# EasyEDA Pro project ChisFlash-MBC5_GBC烧录卡_shn修改plus图纸nds烧录线路+电池加固通孔.epro, schematic ChisFlash-MBC5-Plus-v1.1
Board Name: ChisFlash-MBC5-Plus-v1.1; Create Date: 2024-11-11; Page Name: 1; Project Name: ChisFlash-MBC5（GBC烧录卡）; Schematic Name: ChisFlash-MBC5-Plus-v1.1; Update Date: 2024-11-11; Company: 嘉立创EDA; Page Size: A4; Version: V1.0
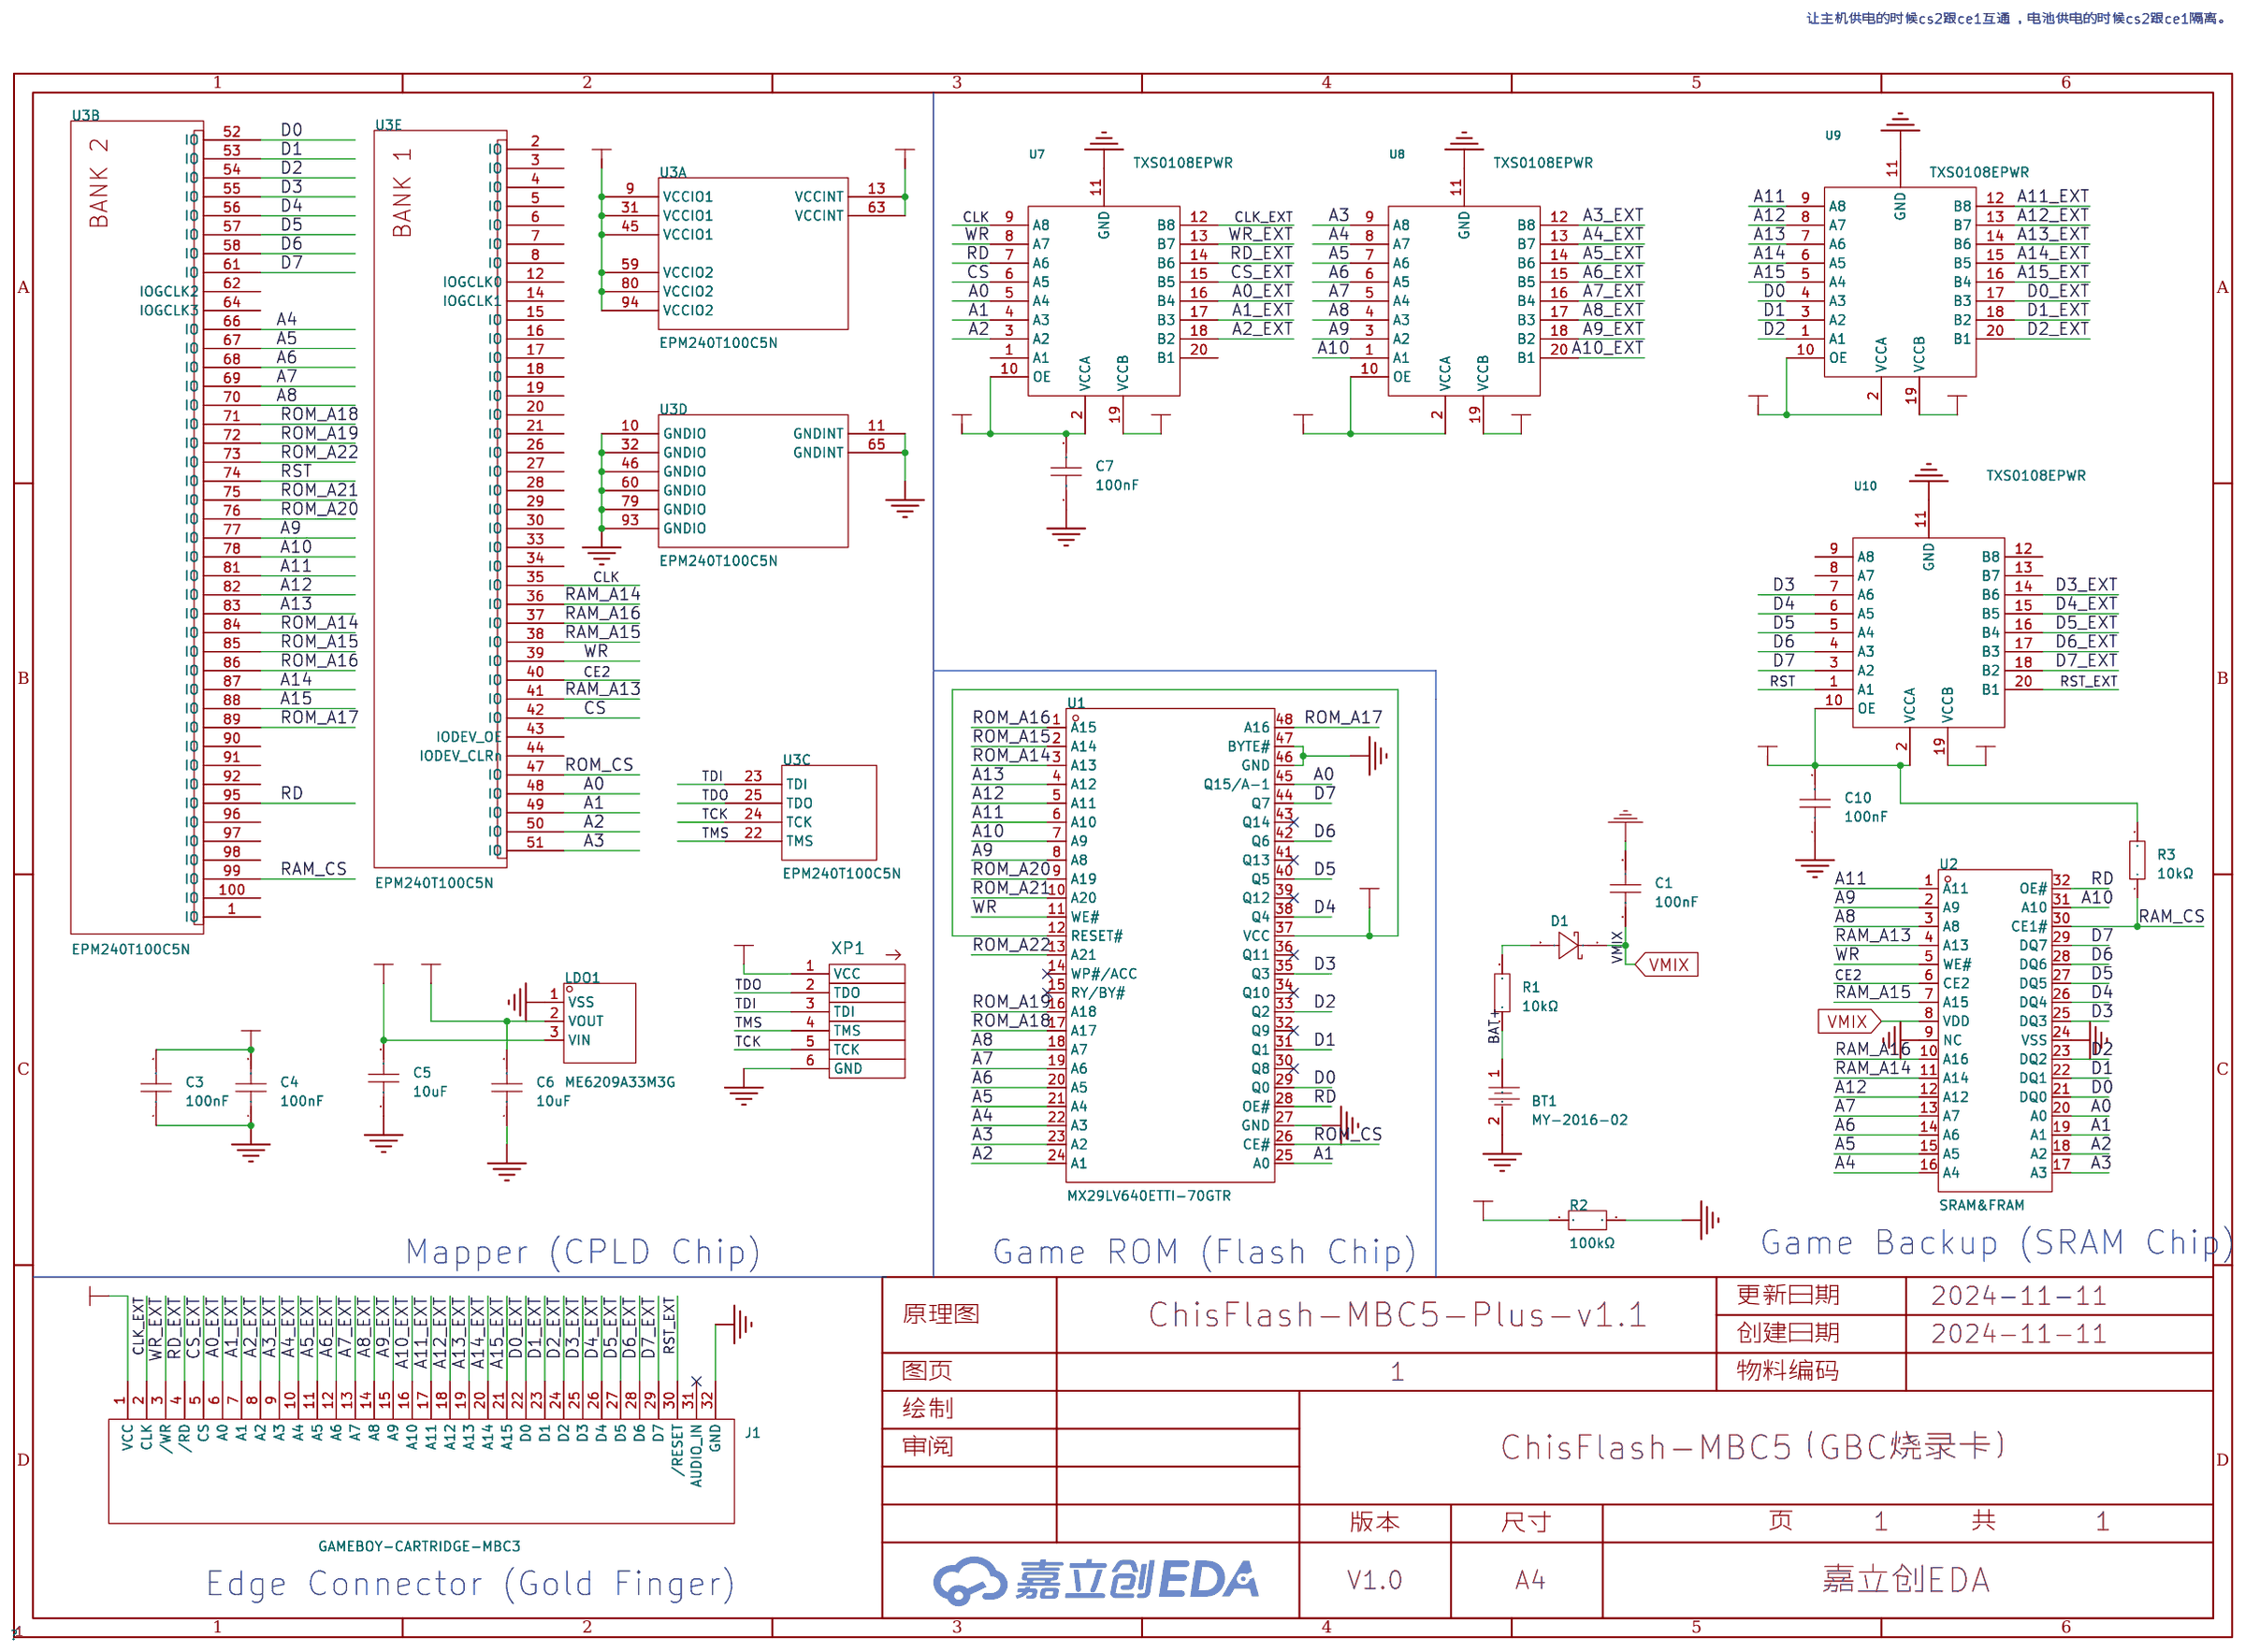
[diagram p0: schematic sheet]

## Parts
BT1  MY-2016-02  [BAT-SMD_MY-2032-08]
C1  100nF  [C0603]
C3  100nF  [C0603]
C4  100nF  [C0603]
C5  10uF  [C0603]
C6  10uF  [C0603]
C7  100nF  [C0603]
C10  100nF  [C0603]
D1  RB751V-40  [SOD-323_L1.7-W1.3-LS2.6-RD-1]
J1  GAMEBOY-CARTRIDGE-MBC3  [GAMEBOY_CARTRIDGE_PIN]
LDO1  ME6209A33M3G  [SOT-23-3_L2.9-W1.6-P1.90-LS2.8-BR]
R1  10kΩ  [R0603]
R2  100kΩ  [R0603]
R3  10kΩ  [R0603]
U1  MX29LV640ETTI-70GTR  [TSOP-48_L12.0-W18.4-P0.50-LS20.0-BL]
U2  SRAM&FRAM  [TSSOP-TSOP二合一]
U3  EPM240T100C5N  [TQFP-100_L14.0-W14.0-P0.50-LS16.0-BL]  (sections 1,2,3,4,5)
U7  TXS0108EPWR  [TSSOP-20_L6.5-W4.4-P0.65-LS6.4-BL]
U8  TXS0108EPWR  [TSSOP-20_L6.5-W4.4-P0.65-LS6.4-BL]
U9  TXS0108EPWR  [TSSOP-20_L6.5-W4.4-P0.65-LS6.4-BL]
U10  TXS0108EPWR  [TSSOP-20_L6.5-W4.4-P0.65-LS6.4-BL]
XP1  JTAG  [HDR-TH_6P-P1.27-V-M-1]  (no BOM)

## Library data of the parts
BT1 = MY-2016-02: 连接器类型:电池扣;适用电池规格:CR2016;触头材质:磷青铜;触点电镀:镍;工作温度范围:-25℃~+85℃;; LCSC Part Name: 电池扣 适用电池:CR2016; Supplier Part: C2979176; Manufacturer: MYOUNG(美阳); Supplier Footprint: SMD; JLCPCB Part Class: Extended Part; Datasheet: https://atta.szlcsc.com/upload/public/pdf/source/20220302/E5D3505CBEA02A6D68587A503653AA7C.pdf; Supplier: LCSC; Connector Type: 电池扣; Battery Type: CR2016; Contact Material: 磷青铜; Contact Plating: 镍; Operating Temperature Range: -25℃~+85℃
C1 C3 C4 C7 C10 = CGA0603X7R104K500JT: 容值:100nF;精度:±10%;额定电压:50V;材质(温度系数):X7R;; LCSC Part Name: 100nF ±10% 50V; Supplier Part: C6119867; Manufacturer: HRE(芯声); Supplier Footprint: 0603; JLCPCB Part Class: Extended Part; Supplier: LCSC; Tolerance: ±10%; Voltage Rated: 50V; Temperature Coefficient: X7R
C5 C6 = CL10A106MA8NRNC: 容值:10uF;精度:±20%;额定电压:25V;材质(温度系数):X5R;; LCSC Part Name: 10uF ±20% 25V; Supplier Part: C96446; Manufacturer: SAMSUNG(三星); Supplier Footprint: 0603; JLCPCB Part Class: 基础库; Datasheet: https://atta.szlcsc.com/upload/public/pdf/source/20160218/1457707763339.pdf; Supplier: LCSC; Tolerance: ±20%; Voltage Rated: 25V; Temperature Coefficient: X5R
D1 = RB751V-40_C7502691: 二极管配置:独立式;正向压降(Vf):370mV@1mA;直流反向耐压(Vr):40V;平均整流电流(Io):30mA;; LCSC Part Name: 电压:40V 电流:30mA; Supplier Part: C7502691; Manufacturer: 宏迦橙; Supplier Footprint: SOD-323; JLCPCB Part Class: Extended Part; Datasheet: https://atta.szlcsc.com/upload/public/pdf/source/20230828/92E6C0C5321000DDFDA2BB61EC3C00B5.pdf; Supplier: LCSC; Diode Configuration: 独立式; Forward Voltage (Vf@If): 370mV@1mA; Reverse Voltage (Vr): 40V; Average Rectified Current (Io): 30mA; Reverse Leakage Current (Ir): 500nA; Peak forward surge current: 200mA
J1 = GAMEBOY-CARTRIDGE-MBC3
LDO1 = ME6209A33M3G: 输出类型:固定;最大输入电压:18V;输出电压:3.3V;最大输出电流:250mA;电源纹波抑制比(PSRR):-;输出极性:正极;; LCSC Part Name: 输入18V 输出3.3V 250mA; Supplier Part: C83508; Manufacturer: MICRONE(南京微盟); Supplier Footprint: SOT-23-3L; JLCPCB Part Class: 扩展库; Datasheet: https://atta.szlcsc.com/upload/public/pdf/source/20161212/1481539101152.pdf; Supplier: LCSC; Output Type: 固定; Maximum Input Voltage: 18V; Output Voltage: 3.3V; MAX Output Current: 250mA; Dropout Voltage: 80mV@(40mA); Output Polarity: 正极; Number of Outputs: 1
R1 R3 = 0603WAF1002T5E: 电阻类型:厚膜电阻;阻值:10kΩ;精度:±1%;功率:100mW;温度系数:±100ppm/℃;最大工作电压:75V;工作温度范围:-55℃~+155℃;; LCSC Part Name: 10kΩ ±1% 100mW; Supplier Part: C25804; Manufacturer: UNI-ROYAL(厚声); Supplier Footprint: 0603; JLCPCB Part Class: Basic Part; Datasheet: https://atta.szlcsc.com/upload/public/pdf/source/20200306/C422600_1E6D84923E4A46A82E41ADD87F860B5C.pdf; Supplier: LCSC; Type: 厚膜电阻; Tolerance: ±1%; Power(Watts): 100mW; Temperature Coefficient: ±100ppm/℃; Overload Voltage (Max): 75V; Operating Temperature Range: -55℃~+155℃; Resistance: 47K
R2 = RT0603BRD1010KL: 电阻类型:薄膜电阻;阻值:10kΩ;精度:±0.1%;功率:100mW;最大工作电压:75V;温度系数:±25ppm/℃;; LCSC Part Name: 薄膜电阻 10kΩ ±0.1% 100mW; Supplier Part: C2087321; Manufacturer: YAGEO(国巨); Supplier Footprint: 0603; JLCPCB Part Class: 扩展库; Datasheet: https://atta.szlcsc.com/upload/public/pdf/source/20200610/C326738_5639A9F1B6EB6E4AE2197577D3456E7F.pdf; Supplier: LCSC; Type: 薄膜电阻; Tolerance: ±0.1%; Power(Watts): 100mW; Overload Voltage (Max): 75V; Temperature Coefficient: ±25ppm/℃; Operating Temperature Range: -55℃~+155℃
U1 = MX29LV640ETTI-70GTR: Supplier Part: C2802730; Manufacturer: MXIC(旺宏电子); JLCPCB Part Class: 扩展库; Supplier: LCSC
U2 = SRAM&FRAM
U3 = EPM240T100C5N: 类型:其它PLD;逻辑门数量:-;逻辑单元数:-;逻辑阵列块数:240;; Supplier Part: C10041; Manufacturer: Intel/Altera; Supplier Footprint: TQFP-100(14x14); JLCPCB Part Class: 扩展库; Datasheet: https://atta.szlcsc.com/upload/public/pdf/source/20121123/1457706563537.pdf; Supplier: LCSC; Type: 其它PLD; Supply Voltage Range - VCCIO: 3.3V；2.5V; Logic Array Blocks: 240; Maximum Delay Time Tpd: 4.7ns; Operating Temperature Range: 0℃~+85℃
U7-U10 = TXS0108EPWR: 数据速率:60Mbps;电压(VCCA):1.4V~3.6V;电压(VCCB):1.65V~5.5V;电路数:1;每个电路通道数:8;; LCSC Part Name: 60Mbps 8位双向电平转换器; Supplier Part: C17206; Manufacturer: TI(德州仪器); Supplier Footprint: TSSOP-20; JLCPCB Part Class: 扩展库; Datasheet: http://www.ti.com/cn/lit/gpn/txs0108e; Supplier: LCSC; Channel Type: 双向; Data Rate: 60Mbps; Supply Voltage (VCCA): 1.4V~3.6V; Supply Voltage (VCCB): 1.65V~5.5V; Number of Circuits: 1; Channels per Circuit: 8; Output Type: 开路漏极；推挽式; Operating Temperature: -40℃~+85℃; Features: 自动方向检测
XP1 = jtag

## Nets
+3V3: C3.2 C4.2 C6.2 C7.2 C10.2 LDO1.2(VOUT) R2.1 R3.2 U1.12(RESET#) U1.37(VCC) U3.9(VCCIO1) U3.13(VCCINT) U3.31(VCCIO1) U3.45(VCCIO1) U3.59(VCCIO2) U3.63(VCCINT) U3.80(VCCIO2) U3.94(VCCIO2) U7.2(VCCA) U7.10(OE) U8.2(VCCA) U8.10(OE) U9.2(VCCA) U9.10(OE) U10.2(VCCA) U10.10(OE) XP1.1(VCC)
+5V: C5.2 J1.1(VCC) LDO1.3(VIN) U7.19(VCCB) U8.19(VCCB) U9.19(VCCB) U10.19(VCCB)
GND: BT1.2 C1.1 C3.1 C4.1 C5.1 C6.1 C7.1 C10.1 J1.32(GND) LDO1.1(VSS) R2.2 U1.27(GND) U1.46(GND) U1.47(BYTE#) U2.9(NC) U2.24(VSS) U3.10(GNDIO) U3.11(GNDINT) U3.32(GNDIO) U3.46(GNDIO) U3.60(GNDIO) U3.65(GNDINT) U3.79(GNDIO) U3.93(GNDIO) U7.11(GND) U8.11(GND) U9.11(GND) U10.11(GND) XP1.6(GND)
A0: U1.45(Q15/A-1) U2.20(A0) U3.48(IO) U7.5(A4)
A0_EXT: J1.6(A0) U7.16(B4)
A1: U1.25(A0) U2.19(A1) U3.49(IO) U7.4(A3)
A1_EXT: J1.7(A1) U7.17(B3)
A2: U1.24(A1) U2.18(A2) U3.50(IO) U7.3(A2)
A2_EXT: J1.8(A2) U7.18(B2)
A3: U1.23(A2) U2.17(A3) U3.51(IO) U8.9(A8)
A3_EXT: J1.9(A3) U8.12(B8)
A4: U1.22(A3) U2.16(A4) U3.66(IO) U8.8(A7)
A4_EXT: J1.10(A4) U8.13(B7)
A5: U1.21(A4) U2.15(A5) U3.67(IO) U8.7(A6)
A5_EXT: J1.11(A5) U8.14(B6)
A6: U1.20(A5) U2.14(A6) U3.68(IO) U8.6(A5)
A6_EXT: J1.12(A6) U8.15(B5)
A7: U1.19(A6) U2.13(A7) U3.69(IO) U8.5(A4)
A7_EXT: J1.13(A7) U8.16(B4)
A8: U1.18(A7) U2.3(A8) U3.70(IO) U8.4(A3)
A8_EXT: J1.14(A8) U8.17(B3)
A9: U1.8(A8) U2.2(A9) U3.77(IO) U8.3(A2)
A9_EXT: J1.15(A9) U8.18(B2)
A10: U1.7(A9) U2.31(A10) U3.78(IO) U8.1(A1)
A10_EXT: J1.16(A10) U8.20(B1)
A11: U1.6(A10) U2.1(A11) U3.81(IO) U9.9(A8)
A11_EXT: J1.17(A11) U9.12(B8)
A12: U1.5(A11) U2.12(A12) U3.82(IO) U9.8(A7)
A12_EXT: J1.18(A12) U9.13(B7)
A13: U1.4(A12) U3.83(IO) U9.7(A6)
A13_EXT: J1.19(A13) U9.14(B6)
A14: U3.87(IO) U9.6(A5)
A14_EXT: J1.20(A14) U9.15(B5)
A15: U3.88(IO) U9.5(A4)
A15_EXT: J1.21(A15) U9.16(B4)
BAT+: BT1.1 R1.1
BATQ1: D1.2(A) R1.2
CE2: U2.6(CE2) U3.40(IO)
CLK: U3.35(IO) U7.9(A8)
CLK_EXT: J1.2(CLK) U7.12(B8)
CS: U3.42(IO) U7.6(A5)
CS_EXT: J1.5(CS) U7.15(B5)
D0: U1.29(Q0) U2.21(DQ0) U3.52(IO) U9.4(A3)
D0_EXT: J1.22(D0) U9.17(B3)
D1: U1.31(Q1) U2.22(DQ1) U3.53(IO) U9.3(A2)
D1_EXT: J1.23(D1) U9.18(B2)
D2: U1.33(Q2) U2.23(DQ2) U3.54(IO) U9.1(A1)
D2_EXT: J1.24(D2) U9.20(B1)
D3: U1.35(Q3) U2.25(DQ3) U3.55(IO) U10.7(A6)
D3_EXT: J1.25(D3) U10.14(B6)
D4: U1.38(Q4) U2.26(DQ4) U3.56(IO) U10.6(A5)
D4_EXT: J1.26(D4) U10.15(B5)
D5: U1.40(Q5) U2.27(DQ5) U3.57(IO) U10.5(A4)
D5_EXT: J1.27(D5) U10.16(B4)
D6: U1.42(Q6) U2.28(DQ6) U3.58(IO) U10.4(A3)
D6_EXT: J1.28(D6) U10.17(B3)
D7: U1.44(Q7) U2.29(DQ7) U3.61(IO) U10.3(A2)
D7_EXT: J1.29(D7) U10.18(B2)
RAM_A13: U2.4(A13) U3.41(IO)
RAM_A14: U2.11(A14) U3.36(IO)
RAM_A15: U2.7(A15) U3.38(IO)
RAM_A16: U2.10(A16) U3.37(IO)
RAM_CS: R3.1 U2.30(CE1#) U3.99(IO)
RD: U1.28(OE#) U2.32(OE#) U3.95(IO) U7.7(A6)
RD_EXT: J1.4(/RD) U7.14(B6)
ROM_A14: U1.3(A13) U3.84(IO)
ROM_A15: U1.2(A14) U3.85(IO)
ROM_A16: U1.1(A15) U3.86(IO)
ROM_A17: U1.48(A16) U3.89(IO)
ROM_A18: U1.17(A17) U3.71(IO)
ROM_A19: U1.16(A18) U3.72(IO)
ROM_A20: U1.9(A19) U3.76(IO)
ROM_A21: U1.10(A20) U3.75(IO)
ROM_A22: U1.13(A21) U3.73(IO)
ROM_CS: U1.26(CE#) U3.47(IO)
RST: U3.74(IO) U10.1(A1)
RST_EXT: J1.30(/RESET) U10.20(B1)
TCK: U3.24(TCK) XP1.5(TCK)
TDI: U3.23(TDI) XP1.3(TDI)
TDO: U3.25(TDO) XP1.2(TDO)
TMS: U3.22(TMS) XP1.4(TMS)
VMIX: C1.2 D1.1(K) U2.8(VDD)
WR: U1.11(WE#) U2.5(WE#) U3.39(IO) U7.8(A7)
WR_EXT: J1.3(/WR) U7.13(B7)

Not connected (* = marked no-connect by the designer): J1 31(AUDIO_IN)*; U1 14(WP#/ACC)* 15(RY/BY#)* 30(Q8)* 32(Q9)* 34(Q10)* 36(Q11)* 39(Q12)* 41(Q13)* 43(Q14)*; U3 1(IO) 2(IO) 3(IO) 4(IO) 5(IO) 6(IO) 7(IO) 8(IO) 12(IOGCLK0) 14(IOGCLK1) 15(IO) 16(IO) 17(IO) 18(IO) 19(IO) 20(IO) 21(IO) 26(IO) 27(IO) 28(IO) 29(IO) 30(IO) 33(IO) 34(IO) 43(IODEV_OE) 44(IODEV_CLRn) 62(IOGCLK2) 64(IOGCLK3) 90(IO) 91(IO) 92(IO) 96(IO) 97(IO) 98(IO) 100(IO); U7 1(A1) 20(B1); U10 8(A7) 9(A8) 12(B8) 13(B7)

## Notes on the sheet
- 让主机供电的时候cs2跟ce1互通 ，电池供电的时候cs2跟ce1隔离。
- Game Backup (SRAM Chip)
- Mapper (CPLD Chip)
- Game ROM (Flash Chip)
- Edge Connector (Gold Finger)
